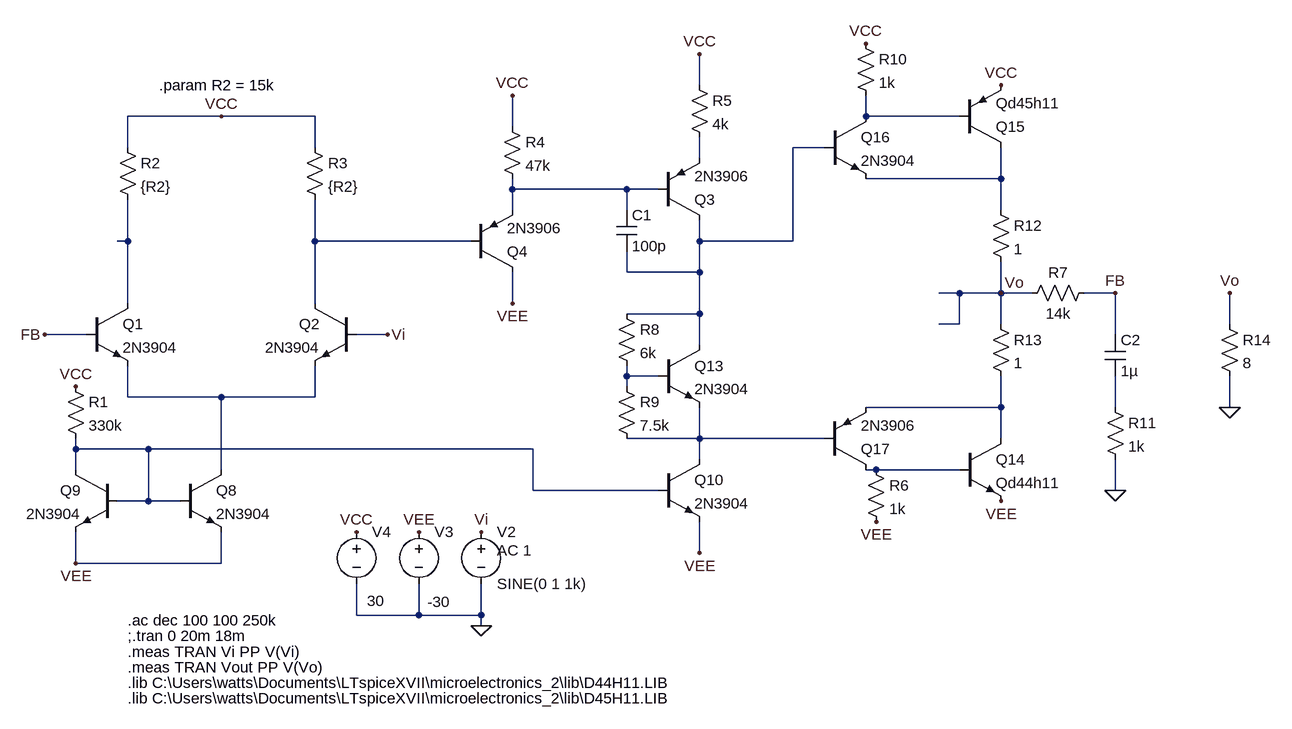
[diagram p0: schematic Lab 6 - Power Amps.asc]
Lab 6 - Power Amps.asc, the LTspice schematic file:
Version 4
SHEET 1 2772 704
WIRE 1184 -832 1184 -880
WIRE 448 -784 304 -784
WIRE 592 -784 448 -784
WIRE 1440 -784 1440 -816
WIRE 1584 -784 1440 -784
WIRE 896 -768 896 -816
WIRE 304 -736 304 -784
WIRE 592 -736 592 -784
WIRE 1376 -736 1328 -736
WIRE 1184 -720 1184 -752
WIRE 1648 -688 1648 -736
WIRE 1648 -688 1440 -688
WIRE 896 -672 896 -688
WIRE 1072 -672 896 -672
WIRE 1120 -672 1072 -672
WIRE 896 -640 896 -672
WIRE 1072 -640 1072 -672
WIRE 1648 -640 1648 -688
WIRE 304 -592 304 -656
WIRE 304 -592 288 -592
WIRE 592 -592 592 -656
WIRE 832 -592 592 -592
WIRE 1184 -592 1184 -624
WIRE 1328 -592 1328 -736
WIRE 1328 -592 1184 -592
WIRE 1072 -544 1072 -576
WIRE 1184 -544 1184 -592
WIRE 1184 -544 1072 -544
WIRE 1584 -512 1552 -512
WIRE 1648 -512 1648 -560
WIRE 1648 -512 1584 -512
WIRE 1696 -512 1648 -512
WIRE 1824 -512 1776 -512
WIRE 304 -496 304 -592
WIRE 592 -496 592 -592
WIRE 896 -496 896 -544
WIRE 1184 -480 1184 -544
WIRE 1184 -480 1072 -480
WIRE 1584 -464 1584 -512
WIRE 1584 -464 1552 -464
WIRE 1648 -464 1648 -512
WIRE 2000 -464 2000 -512
WIRE 240 -448 176 -448
WIRE 704 -448 656 -448
WIRE 1824 -448 1824 -512
WIRE 1184 -432 1184 -480
WIRE 1072 -384 1072 -400
WIRE 1120 -384 1072 -384
WIRE 1072 -368 1072 -384
WIRE 304 -352 304 -400
WIRE 448 -352 304 -352
WIRE 592 -352 592 -400
WIRE 592 -352 448 -352
WIRE 1648 -336 1648 -384
WIRE 1648 -336 1440 -336
WIRE 1824 -336 1824 -384
WIRE 2000 -336 2000 -384
WIRE 1184 -288 1184 -336
WIRE 1184 -288 1072 -288
WIRE 1376 -288 1184 -288
WIRE 1648 -288 1648 -336
WIRE 224 -272 224 -288
WIRE 336 -272 224 -272
WIRE 928 -272 336 -272
WIRE 1184 -256 1184 -288
WIRE 224 -240 224 -272
WIRE 448 -240 448 -352
WIRE 1456 -240 1440 -240
WIRE 1584 -240 1456 -240
WIRE 928 -208 928 -272
WIRE 1120 -208 928 -208
WIRE 1824 -208 1824 -256
WIRE 336 -192 336 -272
WIRE 336 -192 288 -192
WIRE 384 -192 336 -192
WIRE 1184 -112 1184 -160
WIRE 224 -96 224 -144
WIRE 448 -96 448 -144
WIRE 448 -96 224 -96
WIRE 656 -16 656 -64
WIRE 752 -16 752 -64
WIRE 752 -16 656 -16
WIRE 848 -16 848 -64
WIRE 848 -16 752 -16
WIRE 848 0 848 -16
FLAG 848 0 0
FLAG 848 -144 Vi
FLAG 752 -144 VEE
FLAG 656 -144 VCC
FLAG 704 -448 Vi
FLAG 448 -784 VCC
FLAG 224 -368 VCC
FLAG 1184 -880 VCC
FLAG 224 -96 VEE
FLAG 1184 -112 VEE
FLAG 896 -496 VEE
FLAG 896 -816 VCC
FLAG 176 -448 FB
FLAG 1440 -896 VCC
FLAG 1648 -832 VCC
FLAG 1648 -192 VEE
FLAG 1456 -160 VEE
FLAG 1824 -208 0
FLAG 1824 -512 FB
FLAG 1648 -512 Vo
FLAG 2000 -336 0
FLAG 2000 -512 Vo
DATAFLAG 448 -352 ""
DATAFLAG 1264 -592 ""
DATAFLAG 304 -544 ""
DATAFLAG 288 -592 ""
DATAFLAG 1072 -672 ""
DATAFLAG 816 -272 ""
DATAFLAG 1520 -784 ""
DATAFLAG 1552 -688 ""
DATAFLAG 1552 -336 ""
DATAFLAG 1504 -240 ""
DATAFLAG 1280 -288 ""
DATAFLAG 1072 -384 ""
DATAFLAG 1552 -512 ""
DATAFLAG 1552 -464 "I(R7)"
DATAFLAG 1840 -576 "I(R7)*(V(vo)-V(fb))"
DATAFLAG 448 -400 "Ic(Q8)"
DATAFLAG 656 -592 ""
SYMBOL voltage 848 -160 R0
WINDOW 123 24 44 Left 2
WINDOW 39 0 0 Left 0
SYMATTR Value2 AC 1
SYMATTR InstName V2
SYMATTR Value SINE(0 1 1k)
SYMBOL voltage 752 -160 R0
WINDOW 3 13 123 Left 2
SYMATTR Value -30
SYMATTR InstName V3
SYMBOL voltage 656 -160 R0
WINDOW 3 16 122 Left 2
WINDOW 123 0 0 Left 0
WINDOW 39 0 0 Left 0
SYMATTR Value 30
SYMATTR InstName V4
SYMBOL npn 240 -496 R0
SYMATTR InstName Q1
SYMATTR Value 2N3904
SYMBOL npn 656 -496 M0
SYMATTR InstName Q2
SYMATTR Value 2N3904
SYMBOL res 288 -752 R0
SYMATTR InstName R2
SYMATTR Value {R2}
SYMBOL res 576 -752 R0
SYMATTR InstName R3
SYMATTR Value {R2}
SYMBOL res 1168 -848 R0
SYMATTR InstName R5
SYMATTR Value 4k
SYMBOL pnp 1120 -624 M180
SYMATTR InstName Q3
SYMATTR Value 2N3906
SYMBOL npn 384 -240 R0
SYMATTR InstName Q8
SYMATTR Value 2N3904
SYMBOL npn 288 -240 M0
SYMATTR InstName Q9
SYMATTR Value 2N3904
SYMBOL res 208 -384 R0
SYMATTR InstName R1
SYMATTR Value 330k
SYMBOL npn 1120 -256 R0
SYMATTR InstName Q10
SYMATTR Value 2N3904
SYMBOL pnp 832 -544 M180
SYMATTR InstName Q4
SYMATTR Value 2N3906
SYMBOL res 880 -784 R0
SYMATTR InstName R4
SYMATTR Value 47k
SYMBOL npn 1120 -432 R0
SYMATTR InstName Q13
SYMATTR Value 2N3904
SYMBOL res 1056 -496 R0
SYMATTR InstName R8
SYMATTR Value 6k
SYMBOL res 1056 -384 R0
SYMATTR InstName R9
SYMATTR Value 7.5k
SYMBOL pnp 1584 -736 M180
SYMATTR InstName Q15
SYMATTR Value Qd45h11
SYMBOL npn 1584 -288 R0
SYMATTR InstName Q14
SYMATTR Value Qd44h11
SYMBOL npn 1376 -784 R0
SYMATTR InstName Q16
SYMATTR Value 2N3904
SYMBOL res 1424 -912 R0
SYMATTR InstName R10
SYMATTR Value 1k
SYMBOL pnp 1376 -240 M180
SYMATTR InstName Q17
SYMATTR Value 2N3906
SYMBOL res 1440 -256 R0
SYMATTR InstName R6
SYMATTR Value 1k
SYMBOL res 1792 -528 R90
WINDOW 0 0 56 VBottom 2
WINDOW 3 32 56 VTop 2
SYMATTR InstName R7
SYMATTR Value 14k
SYMBOL res 1808 -352 R0
SYMATTR InstName R11
SYMATTR Value 1k
SYMBOL res 1632 -656 R0
SYMATTR InstName R12
SYMATTR Value 1
SYMBOL res 1632 -480 R0
SYMATTR InstName R13
SYMATTR Value 1
SYMBOL res 1984 -480 R0
SYMATTR InstName R14
SYMATTR Value 8
SYMBOL cap 1808 -448 R0
SYMATTR InstName C2
SYMATTR Value 1µ
SYMBOL cap 1056 -640 R0
SYMATTR InstName C1
SYMATTR Value 100p
TEXT 304 40 Left 2 !.meas TRAN Vi PP V(Vi)
TEXT 304 -8 Left 2 !.ac dec 100 100 250k
TEXT 304 16 Left 2 !;.tran 0 20m 18m
TEXT 352 -832 Left 2 !.param R2 = 15k
TEXT 304 64 Left 2 !.meas TRAN Vout PP V(Vo)
TEXT 304 88 Left 2 !.lib C:\\Users\\watts\\Documents\\LTspiceXVII\\microelectronics_2\\lib\\D44H11.LIB
TEXT 304 112 Left 2 !.lib C:\\Users\\watts\\Documents\\LTspiceXVII\\microelectronics_2\\lib\\D45H11.LIB

The netlist it stands for:
* Lab 6 - Power Amps.asc
V2 Vi 0 SINE(0 1 1k) AC 1
V3 VEE 0 -30
V4 VCC 0 30
Q1 N006 FB N009 0 2N3904
Q2 N007 Vi N009 0 2N3904
R2 VCC N006 {R2}
R3 VCC N007 {R2}
R5 VCC N003 4k
Q3 N002 N005 N003 0 2N3906
Q8 N009 N013 VEE 0 2N3904
Q9 N013 N013 VEE 0 2N3904
R1 VCC N013 330k
Q10 N012 N013 VEE 0 2N3904
Q4 VEE N007 N005 0 2N3906
R4 VCC N005 47k
Q13 N002 N008 N012 0 2N3904
R8 N002 N008 6k
R9 N008 N012 7.5k
Q15 N004 N001 VCC 0 Qd45h11
Q14 N010 N014 VEE 0 Qd44h11
Q16 N001 N002 N004 0 2N3904
R10 VCC N001 1k
Q17 N014 N012 N010 0 2N3906
R6 N014 VEE 1k
R7 FB Vo 14k
R11 N011 0 1k
R12 N004 Vo 1
R13 Vo N010 1
R14 Vo 0 8
C2 FB N011 1µ
C1 N005 N002 100p
.model NPN NPN
.model PNP PNP
.lib standard.bjt
.meas TRAN Vi PP V(Vi)
.ac dec 100 100 250k
;.tran 0 20m 18m
.param R2 = 15k
.meas TRAN Vout PP V(Vo)
.lib C:\Users\watts\Documents\LTspiceXVII\microelectronics_2\lib\D44H11.LIB
.lib C:\Users\watts\Documents\LTspiceXVII\microelectronics_2\lib\D45H11.LIB
.backanno
.end